# Altium project PCB_Project.PrjPcb
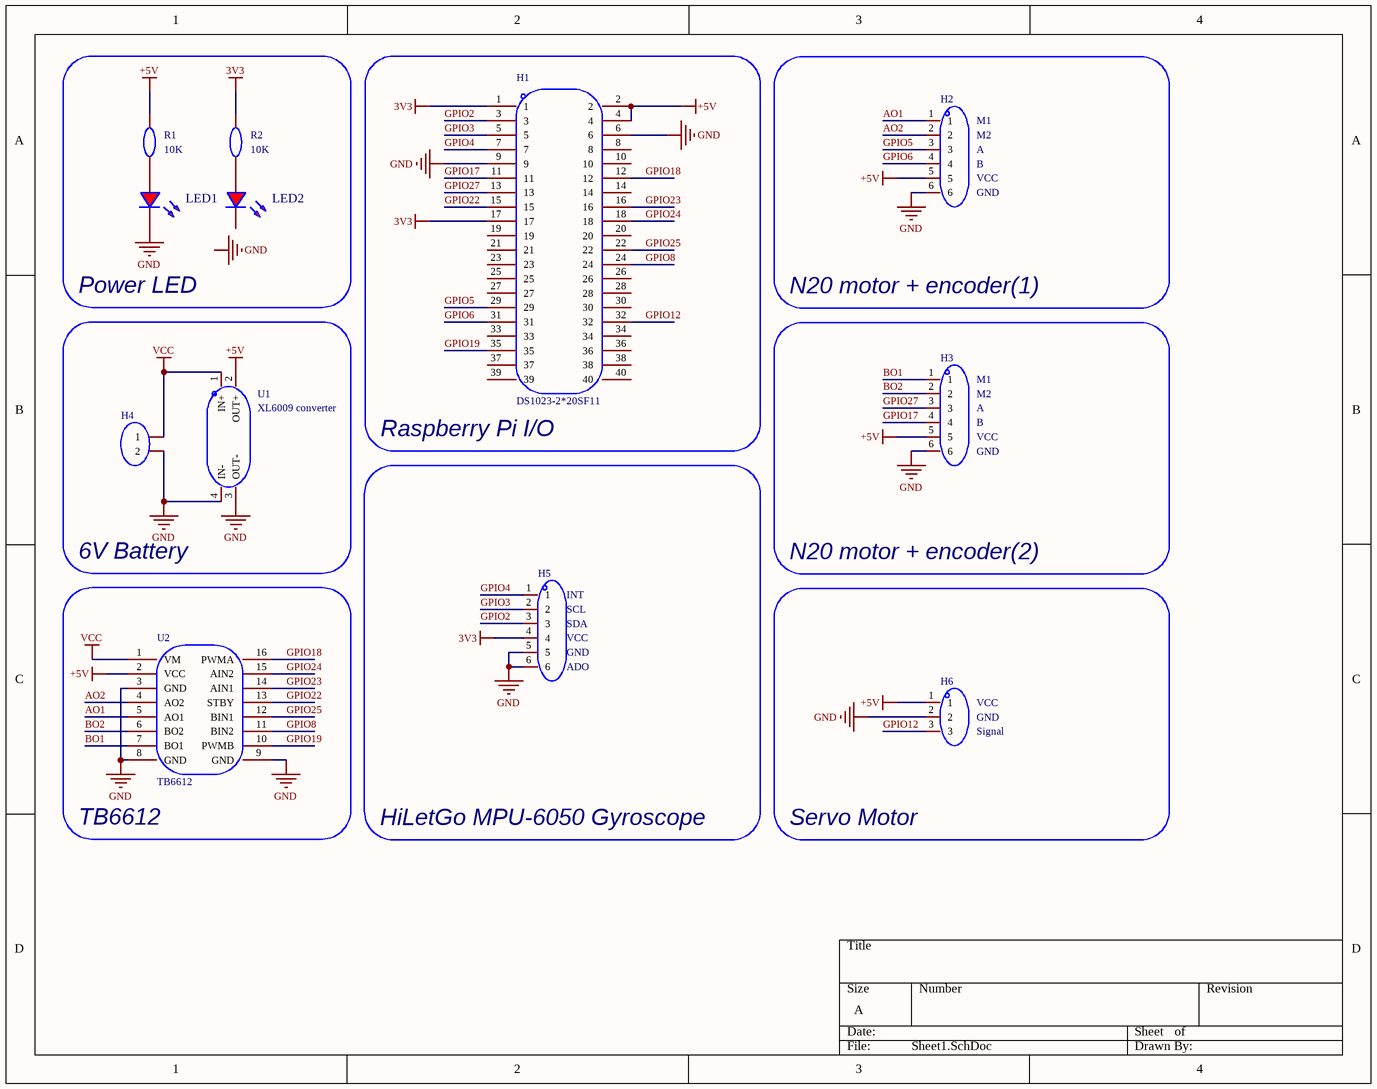
[diagram p0: Sheet1.SchDoc]
1 sheet, 12 parts. Net scope: global (net labels, ports and power ports of the same name join across sheets).
Board file: PCB.pcbdoc

## Sheet Sheet1.SchDoc
size A; SheetNumber: 1; SheetTotal: 1

### Parts
H1  DS1023-2*20SF11  [HDR-TH_40P-P2.54-V-F-R2-C20-S2.54]
H2  (no value)  [HDR-TH_6P-P2.54-V-F]
H3  (no value)  [HDR-TH_6P-P2.54-V-F]
H4  (no value)  [HDR-TH_2P-P2.54-V-F]
H5  (no value)  [HDR-TH_6P-P2.54-V-F]
H6  (no value)  [HDR-TH_3P-P2.54-V-F]
LED1  (no value)  [LED_0603]
LED2  (no value)  [LED_0603]
R1  10K  [R0603]
R2  10K  [R0603]
U1  XL6009 converter  [XFMR-SMD_XL6009]
U2  TB6612  [TB6612]

### Blocks framed on the sheet
Power LED: LED1 LED2 R1 R2
Raspberry Pi I/O: H1
N20 motor + encoder(1): H2
6V Battery: H4 U1
N20 motor + encoder(2): H3
HiLetGo MPU-6050 Gyroscope: H5
TB6612: U2
Servo Motor: H6

### Nets
3V3: H1.1 H1.17 H5.4 R2.2
+5V: H1.2 H1.4 H2.5 H3.5 H6.1 R1.2 U1.2(OUT+) U2.2(VCC)
GND: H1.6 H1.9 H2.6 H3.6 H4.2 H5.5 H5.6 H6.2 LED1.1(C) U1.3(OUT-) U1.4(IN-) U2.3(GND) U2.8(GND) U2.9(GND)
VCC: H4.1 U1.1(IN+) U2.1(VM)
AO1: H2.1 U2.5(AO1)
AO2: H2.2 U2.4(AO2)
BO1: H3.1 U2.7(BO1)
BO2: H3.2 U2.6(BO2)
GPIO2: H1.3 H5.3
GPIO3: H1.5 H5.2
GPIO4: H1.7 H5.1
GPIO5: H1.29 H2.3
GPIO6: H1.31 H2.4
GPIO8: H1.24 U2.11(BIN2)
GPIO12: H1.32 H6.3
GPIO17: H1.11 H3.4
GPIO18: H1.12 U2.16(PWMA)
GPIO19: H1.35 U2.10(PWMB)
GPIO22: H1.15 U2.13(STBY)
GPIO23: H1.16 U2.14(AIN1)
GPIO24: H1.18 U2.15(AIN2)
GPIO25: H1.22 U2.12(BIN1)
GPIO27: H1.13 H3.3
NetLED1_2: LED1.2(A) R1.1
NetLED2_2: LED2.2(A) R2.1

Not connected (* = marked no-connect by the designer): H1 8 10 14 19 20 21 23 25 26 27 28 30 33 34 36 37 38 39 40; LED2 1(C)

### Notes on the sheet
- (near H2) B
- (near H2) A
- (near H2) M2
- (near H2) M1
- (near H2) GND
- (near H2) VCC
- (near H3) M2
- (near H3) M1
- (near H3) GND
- (near H3) VCC
- (near H3) B
- (near H3) A
- (near H5) INT
- (near H5) SCL
- (near H5) SDA
- (near H5) VCC
- (near H5) GND
- (near H5) ADO
- (near H6) VCC
- (near H6) GND
- (near H6) Signal
- Labels drawn without touching a wire or pin: GND

### Library data of the parts
H1 = DS1023-2*20SF11: 插孔结构:2x20P;间距:2.54mm;行距:2.54mm;安装方式:直插;排数:双排;总孔位数:40P;额定电流:3A;额定电压:600V;插孔方向:顶部;塑高:8.5mm;触头材质:-;触头镀层:金;工作温度:-40℃~+105℃;; Manufacturer: CONNFLY; AddInBom: yes; ModelId: 6c85b3860eb24e43a9d123684eb6d3ee聨0819f05c4eef4c71ace90d822a990e87; ModelName: HDR-TH_40P-P2.54-F-LI-2X20P; ModelTransform: 2015.783,196.85,0,0,0,0,0,0,-125.984; Holes Structure: 2x20P; Pitch: 2.54mm; Number of Positions: 40P; Current Rating: 3A; Voltage Rating (Max): 600V; Holes Direction: 顶部; Symbol: DS1023-2*20SF11; Device: DS1023-2*20SF11; LCSC Part Name: 2x20P 间距:2.54mm 直插; SupplierPart: C132132; ManufacturerPart: DS1023-2*20SF11; Supplier Footprint: 插件,P=2.54mm; JLCPCB Part Class: Extended Part; Datasheet: https://item.szlcsc.com/datasheet/DS1023-2*20SF11/143431.html; Supplier: LCSC; ConvertToPcb: yes; FootprintName: HDR-TH_40P-P2.54-V-F-R2-C20-S2.54; Row Spacing: 2.54mm; Mounting Type: 直插; Number of Rows: 双排; Insulation Height: 8.5mm; Contact Material: -; Contact Plating: 金; Operating Temperature: -40℃~+105℃
H2 H3 H5 = HDR-F_2.54_1x6P: Symbol: Header-Female-2.54_1x6; ConvertToPcb: yes; ModelId: 0f5bcf94dcda47d085f24cdca1696fe9聨0819f05c4eef4c71ace90d822a990e87; ModelTransform: 619.684,94.488,0,0,0,0,0,0,-125.984; Device: HDR-F_2.54_1x6P; AddInBom: yes; SupplierPart: C40877; Supplier Footprint: 插件; FootprintName: HDR-TH_6P-P2.54-V-F; ModelName: HDR-TH_6P-P2.54-V-F
H4 = HDR-F_2.54_1x2P: Symbol: Header-Female-2.54_1x2; ConvertToPcb: yes; ModelId: a9450ef445564560a104363b9aacde4e聨0819f05c4eef4c71ace90d822a990e87; ModelName: HDR-TH_2P-P2.54-F-LI-1X2P; ModelTransform: 215.7476,98.425,0,0,0,0,0,0,-129.921; Device: HDR-F_2.54_1x2P; AddInBom: yes; SupplierPart: C49661; Supplier Footprint: 插件; FootprintName: HDR-TH_2P-P2.54-V-F
H6 = HDR-F_2.54_1x3P: Symbol: PM254V-11-03-H85; ConvertToPcb: yes; ModelId: f3b3cc5aae9641bf9e56fc160cef875b聨0819f05c4eef4c71ace90d822a990e87; ModelName: HDR2.54-F-LI-1X3P; ModelTransform: 299.9994,100,0,0,0,0,0,0,-118.11; Device: HDR-F_2.54_1x3P; AddInBom: yes; SupplierPart: C541850; Supplier Footprint: 插件; FootprintName: HDR-TH_3P-P2.54-V-F
LED1 LED2 = LED_0603-R: Symbol: LED_R; Convert to PCB: yes; 3D Model: dd8257b0d61a4cd7b68939a056e08095聨0819f05c4eef4c71ace90d822a990e87; 3D Model Transform: 58.72,29.4,22.03,0,0,0,0,0,0; ModelName: LED-0603_R; Device: LED_0603-R; Add into BOM: yes; Supplier Footprint: 0603; FootprintName: LED_0603
R1 R2 = Res_0603: Symbol: 电阻; ConvertToPcb: yes; ModelId: fc143cca1e79419f9cd78b61e9279f08聨0819f05c4eef4c71ace90d822a990e87; ModelTransform: 31.8897,63.7794,0,90,0,0,0,0,0; Device: Res_0603; AddInBom: yes; Supplier Footprint: 0603; FootprintName: R0603; ModelName: R0603; Value: 10K
U1 = xl6009模块: AddInBom: yes; ModelId: 83ebc66238764235a18464c80c3c8e11聨0819f05c4eef4c71ace90d822a990e87; ModelTransform: 1699.9966,829.998,0,0,0,0,0,0,0; Symbol: XL6009模块; Device: xl6009模块; LCSC Part Name: xl6009模块; SupplierPart: C2908146; ManufacturerPart: xl6009模块; Supplier Footprint: SMD-4P; JLCPCB Part Class: Extended Part; Supplier: LCSC; ConvertToPcb: yes; FootprintName: XFMR-SMD_XL6009; ModelName: XFMR-SMD_XL6009
U2 = TB6612: AddInBom: yes; Symbol: TB6612; Device: TB6612; ConvertToPcb: yes; FootprintName: TB6612